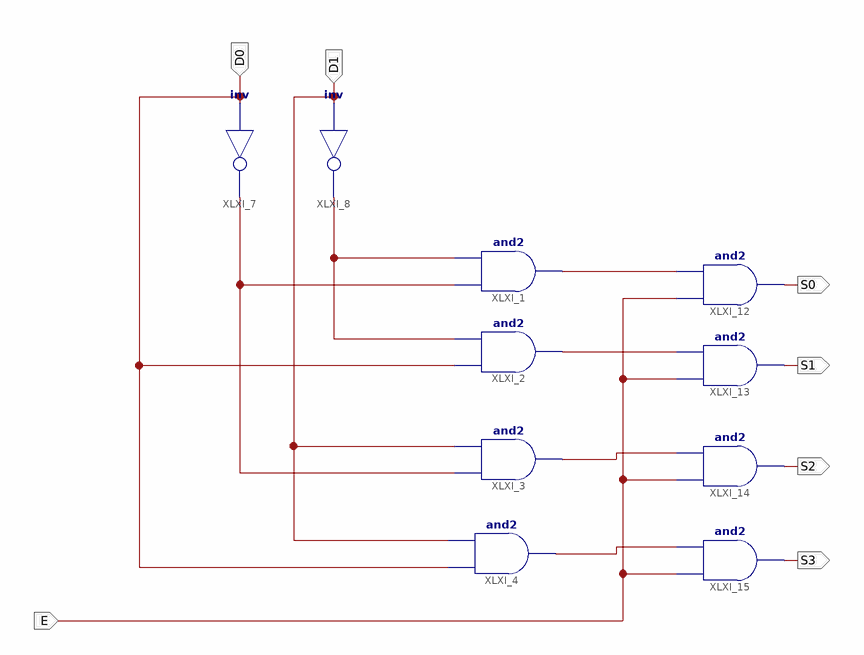
[diagram p0: schematic sheet 1]
// Xilinx ISE schematic deco2_4.sch (artix7) as structural Verilog: 10 symbols, 7 ports
module deco2_4 (
  input  D0,
  input  D1,
  input  E,
  output S0,
  output S1,
  output S2,
  output S3
);

  wire XLXN_24, XLXN_28, XLXN_36, XLXN_37, XLXN_38, XLXN_39;

  and XLXI_1 (XLXN_39, XLXN_28, XLXN_24);
  and XLXI_2 (XLXN_38, D0, XLXN_24);
  and XLXI_3 (XLXN_37, XLXN_28, D1);
  and XLXI_4 (XLXN_36, D0, D1);
  not XLXI_8 (XLXN_24, D1);
  not XLXI_7 (XLXN_28, D0);
  and XLXI_12 (S0, E, XLXN_39);
  and XLXI_13 (S1, E, XLXN_38);
  and XLXI_14 (S2, E, XLXN_37);
  and XLXI_15 (S3, E, XLXN_36);
endmodule
